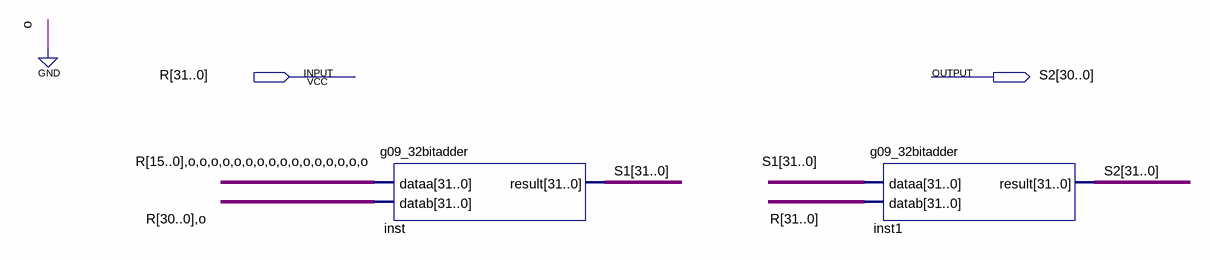
[diagram p0: schematic sheet]
// Quartus schematic g09_RANDU.bdf as structural Verilog: 2 symbols, 2 pins
module g09_RANDU (
  input  [31:0] R,
  output [31:0] S2
);

  wire [31:0] S1;

  g09_32bitadder inst (.dataa({R[15:0], {16{1'b0}}}), .datab({R[30:0], 1'b0}), .result(S1));
  g09_32bitadder inst1 (.dataa(S1), .datab(R), .result(S2));
endmodule
